# Altium project Wien.PrjPcb
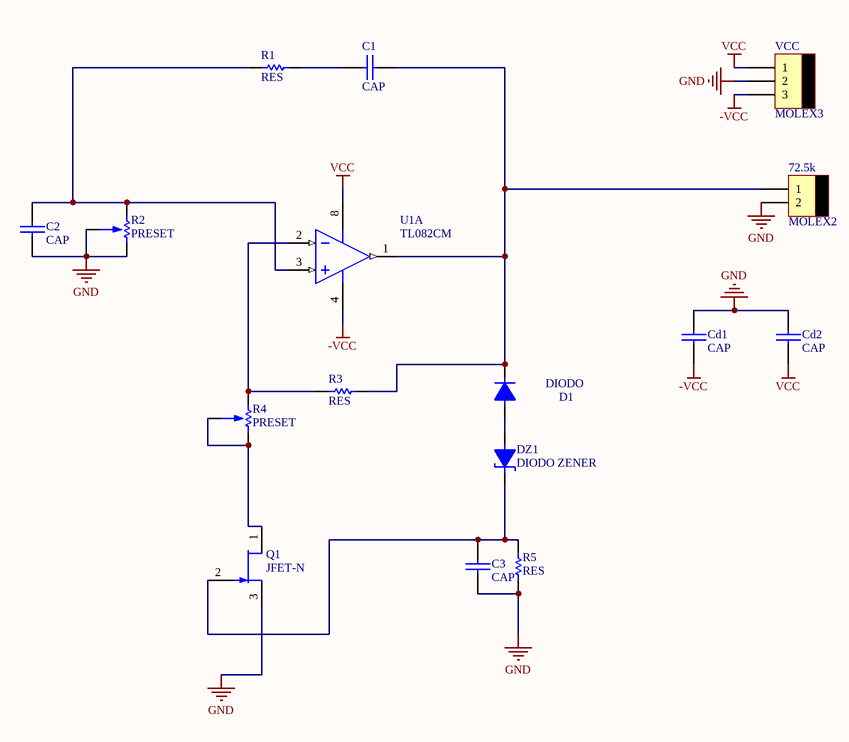
[diagram p0: Sheet2.SchDoc]
1 sheet, 16 parts. Net scope: global (net labels, ports and power ports of the same name join across sheets).
Board file: PCB1.PcbDoc

## Sheet Sheet2.SchDoc
size A

### Parts
72.5k  MOLEX2  [MOLEX2]
C1  CAP  [0805]
C2  CAP  [0805]
C3  CAP  [0805]
Cd1  CAP  [0805]
Cd2  CAP  [0805]
D1  DIODO  [DO41]
DZ1  DIODO ZENER  [DO41]
Q1  JFET-N  [TO-254-AA]
R1  RES  [0805]
R2  PRESET  [PRESET V]
R3  RES  [0805]
R4  PRESET  [PRESET V]
R5  RES  [0805]
U1  TL082CM  [M08A_N]  (part A of 2)
VCC  MOLEX3  [MOLEX3]

### Nets
-VCC: Cd1.2 U1.4(V-) VCC.3
GND: 72.5k.2 C2.2 C3.1 Cd1.1 Cd2.1 Q1.3(S) R2.1 R2.2 R5.1 VCC.2
VCC: Cd2.2 U1.8(V+) VCC.1
Net72.5k_1: 72.5k.1 C1.2 D1.2 R3.2 U1.1(OUTA)
NetC1_1: C1.1 R1.1
NetC2_1: C2.1 R1.2 R2.3 U1.3(INA+)
NetC3_2: C3.2 DZ1.2 Q1.2(G) R5.2
NetD1_1: D1.1 DZ1.1
NetQ1_1: Q1.1(D) R4.1 R4.2
NetR3_1: R3.1 R4.3 U1.2(INA-)

### Library data of the parts
Q1 = JFET-N: N-Channel JFET; Published: 8-Jun-2000; LatestRevisionDate: 17-Jul-2002; LatestRevisionNote: Re-released for DXP Platform.; PackageReference: TO-254-AA; Publisher: Altium Limited; Code_JEDEC: TO-254-AA
U1 = TL082CM: Wide Bandwidth Dual JFET Input Operational Amplifier, 8-pin Narrow SOIC; Manufacturer: National Semiconductor; PackageTopMarking: NSZXTT*TL*082CM; PowerWise: N; CompType: Amplifiers; Published: 4-Dec-2008; LatestRevisionDate: 13-Jan-2009; LatestRevisionNote: Sim Model Added.; DatasheetVersion: Aug-2000; PackageVersion: revM, May-2009; PackageReference: M08A; Publisher: Altium Limited; PackageDescription: SOIC Narrow, 4.9 x 3.9 x 1.45mm, 8 Lead, 1.27mm Pitch; Supplier 1: Digi-Key; Supplier Part Number 1: TL082CM-ND; PartNumber: TL082CM; RoHS: N; PinCount: 8; Code_JEDEC: MS-012-AA; Code_IPC: SOIC127P600-8; ComponentLink1Description: TL082 Datasheet; ComponentLink1URL: http://www.national.com/ds/TL/TL082.pdf; ComponentLink2Description: TL082 Web Page; ComponentLink2URL: http://www.national.com/pf/TL/TL082.html; ComponentLink3Description: M08A Package Page; ComponentLink3URL: http://www.national.com/packaging/folders/m08a.html